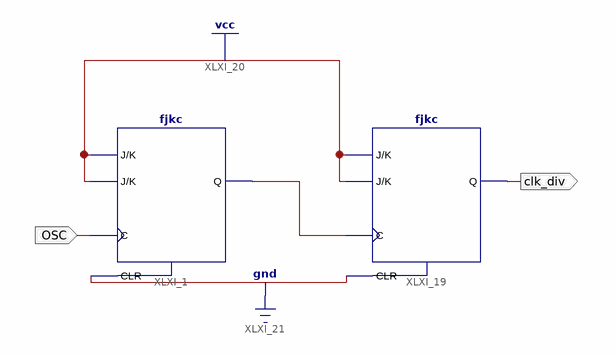
[diagram p0: schematic sheet 1]
// Xilinx ISE schematic mini_clk_div.sch (spartan6) as structural Verilog: 2 symbols, 2 ports
module mini_clk_div (
  input  OSC,
  output clk_div
);

  wire XLXN_6;

  fjkc XLXI_1 (.C(OSC), .CLR(1'b0), .J(1'b1), .K(1'b1), .Q(XLXN_6));
  fjkc XLXI_19 (.C(XLXN_6), .CLR(1'b0), .J(1'b1), .K(1'b1), .Q(clk_div));
endmodule
